# EasyEDA schematic SCH_CLASS_ESP32-S2-MAIN_2024-03-13.json
TITLE: ESP32_S2-MAIN-CONTROL; REV: 1.9; Date: 2023-12-26; Sheet: 1/1; Drawn By: aamirf; Company: Your Company
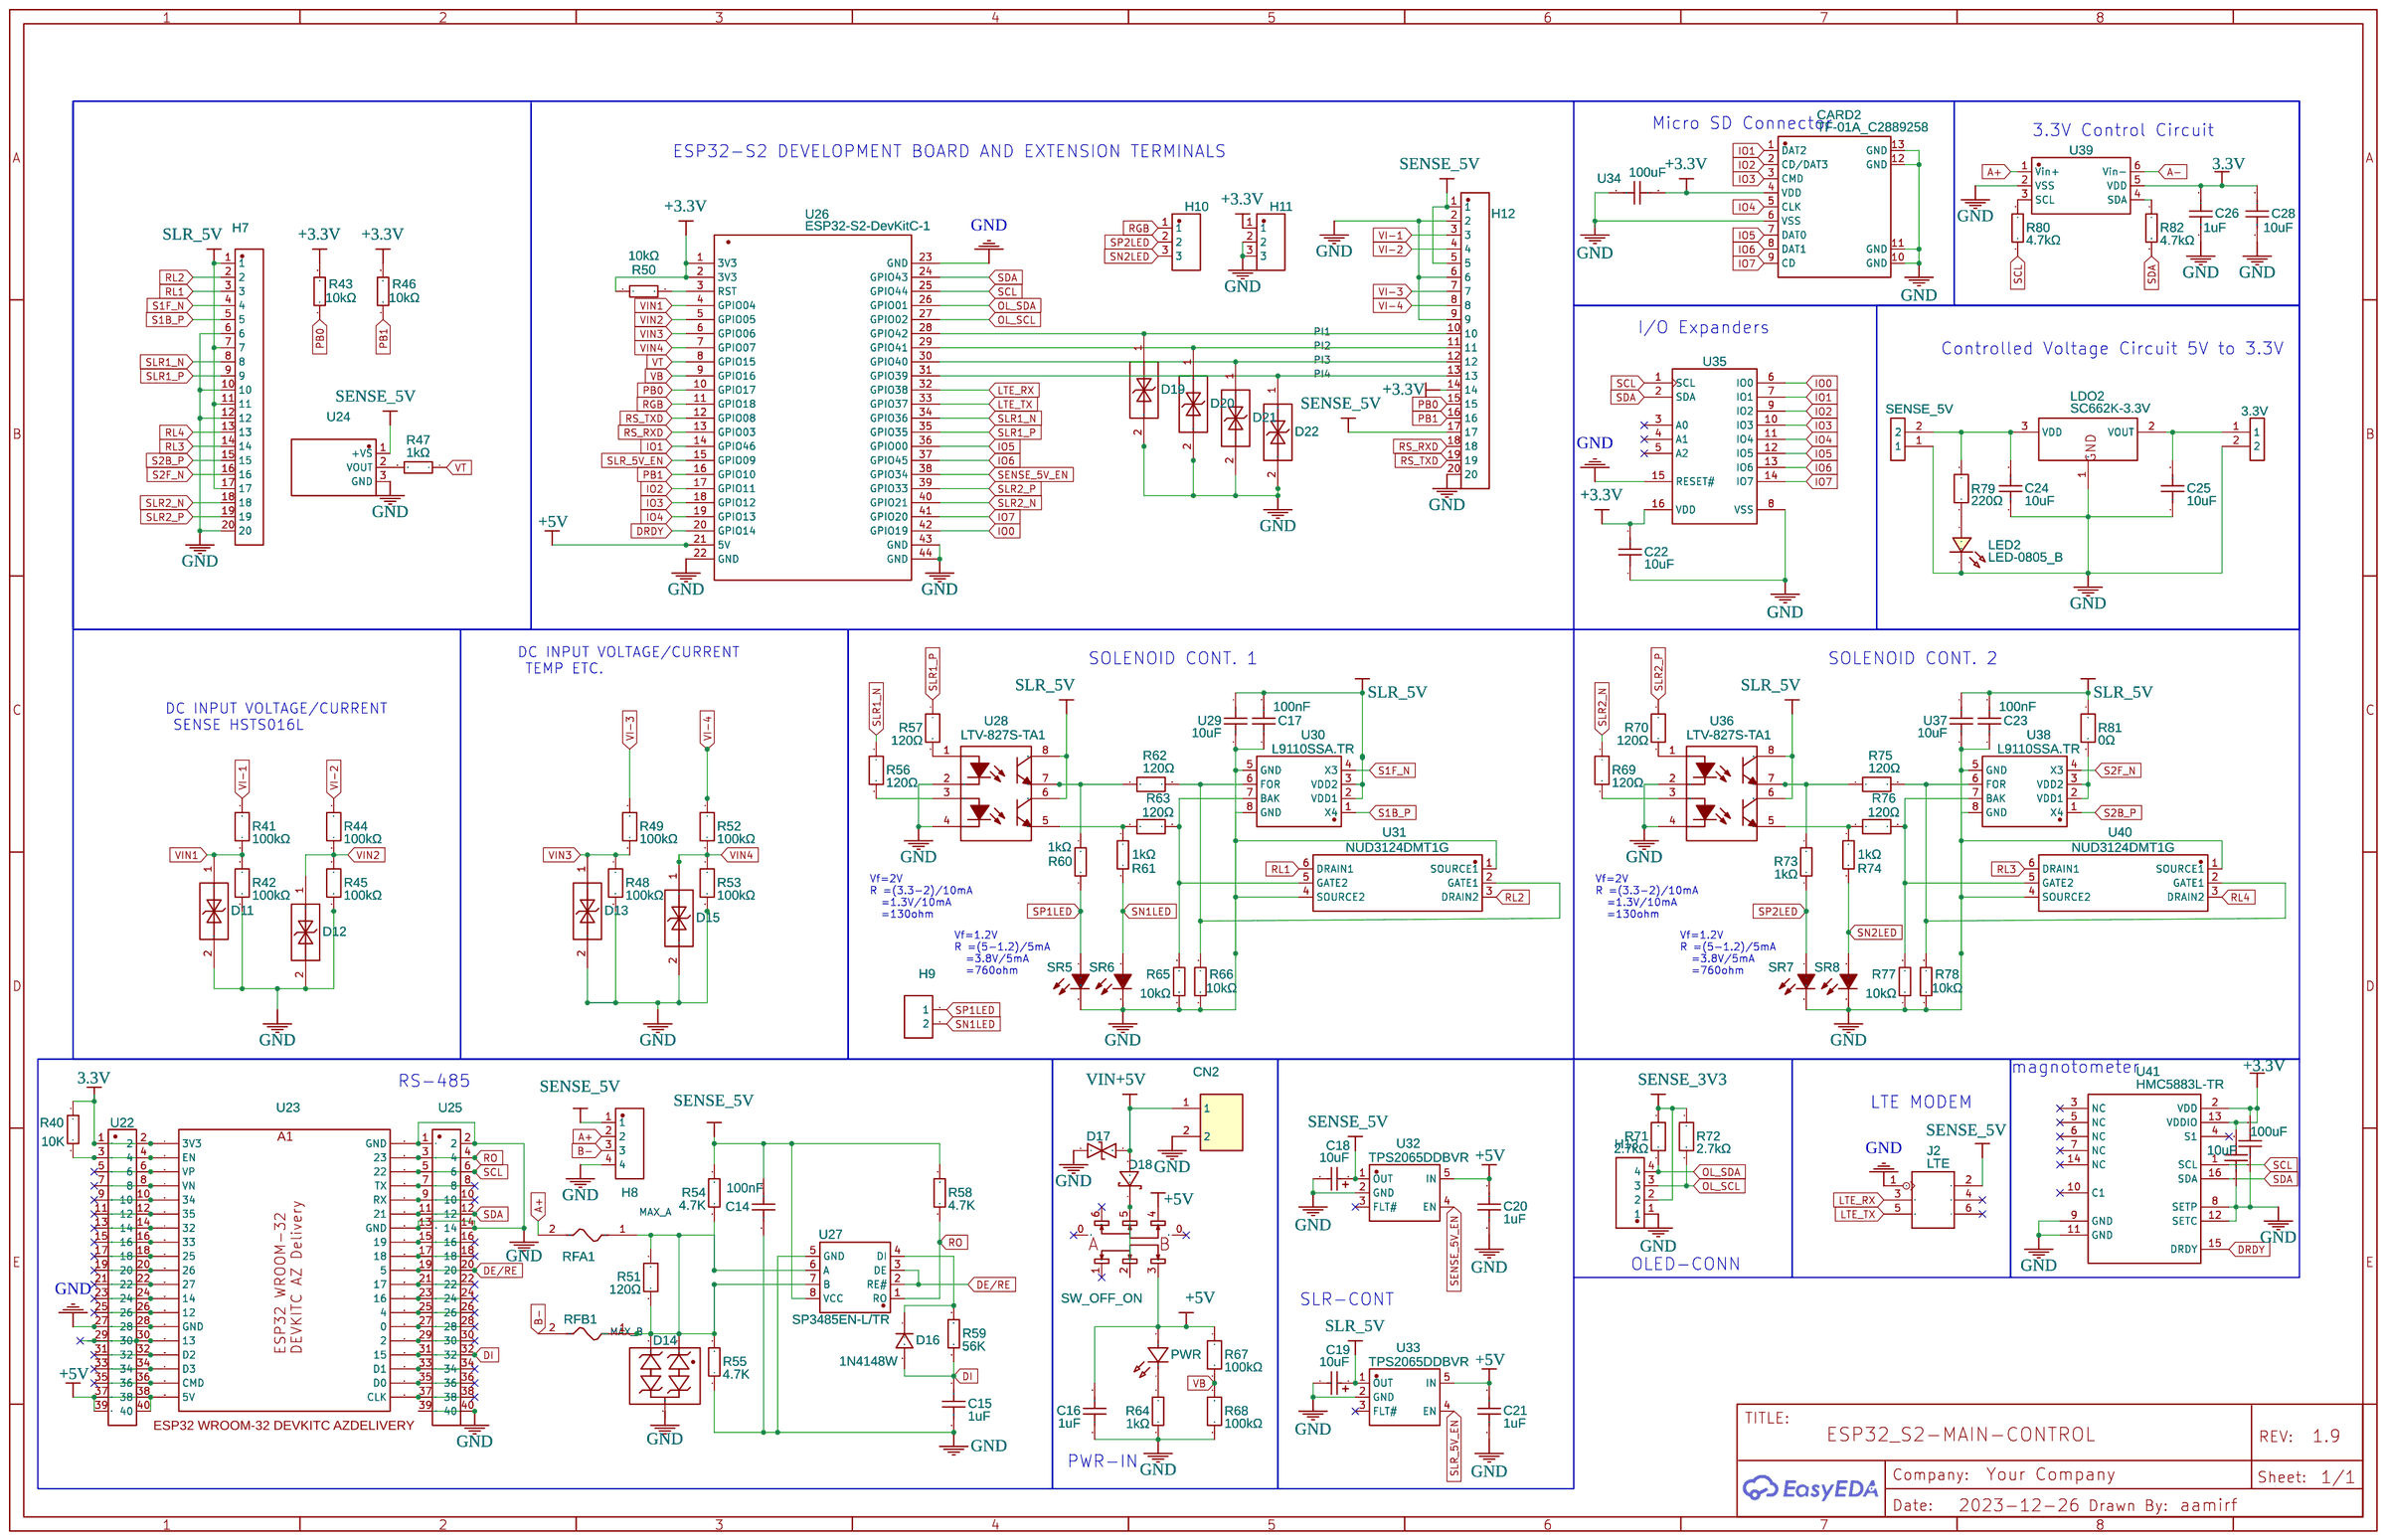
[diagram p0: schematic sheet]

## Parts
C14  100nF  [C0402]
C15  1uF  [C0402]
C16  1uF  [C0402]
C17  100nF  [C0402]
C18  10uF  [CASE-A_3216]
C19  10uF  [CASE-A_3216]
C20  1uF  [C0402]
C21  1uF  [C0402]
C22  10uF  [C0805]
C23  100nF  [C0402]
C24  10uF  [C0805]
C25  10uF  [C0805]
C26  1uF  [C0402]
C27  10uF  [C1206]
C28  10uF  [C0805]
CARD2  TF-01A_C2889258  [TF-SMD_TF-02]
CN2  B2B-PH-K-S(LF)(SN)  [CONN-TH_B2B-PH-K-S]
D11  KESD5311X  [D0402-BI]
D12  KESD5311X  [D0402-BI]
D13  KESD5311X  [D0402-BI]
D14  SM712_C502564  [SOT-23-3_L2.9-W1.6-P1.90-LS2.8-BR]
D15  KESD5311X  [D0402-BI]
D16  1N4148W  [SOD-123_L2.8-W1.8-LS3.7-RD]
D17  LESD5D5.0CT1G  [SOD-523_L1.2-W0.8-LS1.6-BI]
D18  BAT760-7  [SOD-323_L1.8-W1.3-LS2.5-RD]
D19  KESD5311X  [D0402-BI]
D20  KESD5311X  [D0402-BI]
D21  KESD5311X  [D0402-BI]
D22  KESD5311X  [D0402-BI]
H7  KH-2.54PH180-1X20P-L11.5  [HDR-TH_20P-P2.54-V-M]
H8  X6511WV-04H-C30D60  [HDR-TH_4P-P2.54-V-M]
H9  HDR-F-2.54_1x2  [HDR-F-2.54_1X2]
H10  KH-2.54PH180-1X3P-L11.5  [HDR-TH_3P-P2.54-V-M]
H11  KH-2.54PH180-1X3P-L11.5  [HDR-TH_3P-P2.54-V-M]
H12  KH-2.54PH180-1X20P-L11.5  [HDR-TH_20P-P2.54-V-M]
H13  X6511WV-04H-C30D60  [HDR-TH_4P-P2.54-V-M]
J2  LTE  [HEADER 2X3-2.54]
LDO2  SC662K-3.3V  [SOT-23-3_L2.9-W1.3-P1.90-LS2.4-BR]
LED2  LED-0805_B  [LED0805_BLUE]
PWR  16-213/BHC-ZL1M2B6Y/3T  [LED0402-RD_BLUE]
PWR_4V  SENSE_5V  [CONN-02-5-SMD]
PWR_5V  3.3V  [CONN-02-5-SMD]
R40  10K  [R0603]
R41  100kΩ  [R0402]
R42  100kΩ  [R0402]
R43  10kΩ  [R0402]
R44  100kΩ  [R0402]
R45  100kΩ  [R0402]
R46  10kΩ  [R0402]
R47  1kΩ  [R0402]
R48  100kΩ  [R0402]
R49  100kΩ  [R0402]
R50  10kΩ  [R0402]
R51  120Ω  [R0603]
R52  100kΩ  [R0402]
R53  100kΩ  [R0402]
R54  4.7K  [R0603]
R55  4.7K  [R0603]
R56  120Ω  [R0402]
R57  120Ω  [R0402]
R58  4.7K  [R0603]
R59  56K  [R0603]
R60  1kΩ  [R0402]
R61  1kΩ  [R0402]
R62  120Ω  [R0402]
R63  120Ω  [R0402]
R64  1kΩ  [R0402]
R65  10kΩ  [R0402]
R66  10kΩ  [R0402]
R67  100kΩ  [R0402]
R68  100kΩ  [R0402]
R69  120Ω  [R0402]
R70  120Ω  [R0402]
R71  2.7kΩ  [R0402]
R72  2.7kΩ  [R0402]
R73  1kΩ  [R0402]
R74  1kΩ  [R0402]
R75  120Ω  [R0402]
R76  120Ω  [R0402]
R77  10kΩ  [R0402]
R78  10kΩ  [R0402]
R79  220Ω  [R0402]
R80  4.7kΩ  [R0402]
R81  0Ω  [R0603]
R82  4.7kΩ  [R0402]
RFA1  MF-MSMF010-2  [F1812]
RFB1  MF-MSMF010-2  [F1812]
SR5  16-213/GHC-YR1S1/3T  [LED0402-R-RD]
SR6  16-213/SDRC/S530-A3/TR8  [LED0402-RD]
SR7  16-213/GHC-YR1S1/3T  [LED0402-R-RD]
SR8  16-213/SDRC/S530-A3/TR8  [LED0402-RD]
SW2  SW_OFF_ON  [SW-SMD_6P-L7.7-W5.6-P2.50]
U22  SCHLIB_C2685092Connector_SMD_40pin  [C2685092CONNECTOR_SMD_FOOTPRINT]
U23  ESP_32_40_SMD_symbol  [ESP_32_SMD_FOOTPRINT]
U24  LM35DZ/LFT1  [TO-92-3_L4.8-W3.7-P2.54-L]
U25  SCHLIB_C2685092Connector_SMD_40pin  [C2685092CONNECTOR_SMD_FOOTPRINT]
U26  ESP32-S2-DevKitC-1  [ESP32-S2-DEVKITC-1]
U27  SP3485EN-L/TR  [SOIC-8_L5.0-W4.0-P1.27-LS6.0-BL]
U28  LTV-827S-TA1  [SMD-8_6.3MM]
U29  10uF  [C0603]
U30  L9110SSA.TR  [SOP-8_L5.0-W3.9-P1.27-LS6.0-BL]
U31  NUD3124DMT1G  [SC-74-6_L3.0-W1.5-P0.95-LS2.8-BL]
U32  TPS2065DDBVR  [SOT-23-5_L3.0-W1.7-P0.95-LS2.8-BL]
U33  TPS2065DDBVR  [SOT-23-5_L3.0-W1.7-P0.95-LS2.8-BL]
U34  100uF  [C1206]
U35  PCA9557PW,118  [TSSOP-16_L5.0-W4.4-P0.65-LS6.4-BL]
U36  LTV-827S-TA1  [SMD-8_6.3MM]
U37  10uF  [C0603]
U38  L9110SSA.TR  [SOP-8_L5.0-W3.9-P1.27-LS6.0-BL]
U39  MCP3421A0T-E/CH  [SOT-23-6_L2.9-W1.6-P0.95-LS2.8-BR]
U40  NUD3124DMT1G  [SC-74-6_L3.0-W1.5-P0.95-LS2.8-BL]
U41  HMC5883L-TR  [LGA-16_L3.0-W3.0-P0.50-BL_SQ]
U42  100uF  [C1206]

## Library data of the parts
C14 C17 C23 = C1005X5R0J104K050BA: Contributor: lcsc; Supplier: LCSC; Supplier Part: C3845188; Manufacturer: TDK; link: https://lcsc.com/eda_search?q=C3845188&%26type=1&ref=editor
C15 C16 C20 C21 C26 = GRM155R61H105ME05D: Contributor: lcsc; Supplier: LCSC; Supplier Part: C5119299; Manufacturer: muRata(村田); JLCPCB Part Class: Extended Part; link: https://lcsc.com/eda_search?q=C5119299&%26type=1&ref=editor
C18 C19 = CA45A-A-16V-10UF-K: Contributor: LCSC; Supplier: LCSC; Manufacturer: CEC(振华新云); Manufacturer Part: CA45A-A-16V-10uF-K; Supplier Part: C129279; JLCPCB Part Class: Extended Part
C22 C28 = C2012X5R1E106M125AB: Contributor: lcsc; Supplier: LCSC; Supplier Part: C3853143; Manufacturer: TDK
C24 C25 = C2012JB1E106K085AC: Contributor: lcsc; Supplier: LCSC; Supplier Part: C3902947; Manufacturer: TDK
C27 = C3216JB1C106M085AB: Contributor: lcsc; Supplier: LCSC; Supplier Part: C3874147; Manufacturer: TDK
CARD2 = TF-01A_C2889258: Contributor: LCSC; Supplier: LCSC; Supplier Part: C2889258; Manufacturer: Yuandi(台湾元迪); Manufacturer Part: TF-01A; JLCPCB Part Class: Extended Part
CN2 = B2B-PH-K-S(LF)(SN): Contributor: LCSC; Supplier: LCSC; Manufacturer: JST; Supplier Part: C131337; JLCPCB Part Class: Extended Part; link: https://lcsc.com/eda_search?q=C131337&%26type=1&ref=editor
D11-D13 D15 D19-D22 = KESD5311X: Contributor: lcsc; Supplier: LCSC; Supplier Part: C2892495; Manufacturer: KUU; JLCPCB Part Class: Extended Part
D14 = SM712_C502564: Contributor: LCSC; Supplier: LCSC; Supplier Part: C502564; Manufacturer: MDD; Manufacturer Part: SM712; JLCPCB Part Class: Extended Part
D16 = 1N4148W_C81598: Supplier: LCSC; Manufacturer: SEMTECH; image: //image.lceda.cn/szlcsc/C81598.jpg; Supplier Part: C81598; LCSC Assembly: Yes; SMT Type: Basic
D17 = LESD5D5.0CT1G: Contributor: LCSC; Supplier: LCSC; Supplier Part: C383211; Manufacturer: LRC(乐山无线电); JLCPCB Part Class: Extended Part; link: https://lcsc.com/eda_search?q=C383211&%26type=1&ref=editor
D18 = BAT760-7: Contributor: LCSC; Supplier: LCSC; Manufacturer: DIODES(美台); Supplier Part: C124187; JLCPCB Part Class: Extended Part; link: https://lcsc.com/eda_search?q=C124187&%26type=1&ref=editor
H7 H12 = KH-2.54PH180-1X20P-L11.5: Contributor: LCSC; Supplier: LCSC; Supplier Part: C2905493; Manufacturer: kinghelm(金航标); JLCPCB Part Class: Extended Part
H8 H13 = X6511WV-04H-C30D60: Contributor: LCSC; Supplier: LCSC; Supplier Part: C706876; Manufacturer: XKB Connectivity(中国星坤); JLCPCB Part Class: Extended Part
H9 = HDR-F-2.54_1x2: Supplier Part: C49661; Supplier: LCSC; Contributor: LCEDA_Lib
H10 H11 = KH-2.54PH180-1X3P-L11.5: Contributor: LCSC; Supplier: LCSC; Supplier Part: C2932698; Manufacturer: kinghelm(金航标); JLCPCB Part Class: Extended Part
J2 = MALE-HEADER(2X3P-2.54): Contributor: hphoa
LDO2 = SC662K-3.3V: Supplier: LCSC; Manufacturer: FM(富满); Supplier Part: C83932; JLCPCB Part Class: Extended Part
LED2 = LED-0805_B: Manufacturer: 方舟 ARKLED; Manufacturer Part: D-B080508B1-KS2; Supplier Part: C108412; Contributor: LCEDA_Lib
PWR = 16-213/BHC-ZL1M2B6Y/3T: Contributor: lcsc; Supplier: LCSC; Supplier Part: C2844007; Manufacturer: EVERLIGHT(亿光); JLCPCB Part Class: Extended Part
PWR_4V PWR_5V = CONN-02-5-SMD: Manufacturer Part: 950-D-SMD-DS/02; Supplier: Digi-Key; Supplier Part: 3072-950-D-SMD-DS/02-ND; link: https://wecoconnectors.com/wp-content/uploads/pdf_sheets_en/950-D-SMD-DS_en.pdf; Contributor: mubashirlio
R40 = RTT12621JTP: Supplier: LCSC; Manufacturer: RALEC(旺诠); Supplier Part: C105036; Resistance (Ohms): 620; JLCPCB Part Class: Extended Part
R41 R42 R44 R45 R48 R49 R52 R53 R67 R68 = CQ02WGJ0104TCE: Contributor: LCSC; Supplier: LCSC; Supplier Part: C966710; Manufacturer: UNI-ROYAL(厚声); JLCPCB Part Class: Extended Part; link: https://lcsc.com/eda_search?q=C966710&%26type=1&ref=editor
R43 R46 R50 R65 R66 R77 R78 = 0402WGF1002TCE: Supplier: LCSC; Manufacturer: UNI-ROYAL(厚声); Supplier Part: C25744; JLCPCB Part Class: Basic Part; link: https://lcsc.com/eda_search?q=C25744&%26type=1&ref=editor; Package Display: No
R47 R60 R61 R64 R73 R74 = AR02DTD1001: Contributor: LCSC; Supplier: LCSC; Supplier Part: C319807; Manufacturer: Viking(光颉); JLCPCB Part Class: Extended Part; link: https://lcsc.com/eda_search?q=C319807&%26type=1&ref=editor
R51 = FRC0603J121 TS: Contributor: lcsc; Supplier: LCSC; Supplier Part: C2907096; Manufacturer: FOJAN(富捷); JLCPCB Part Class: Extended Part; link: https://lcsc.com/eda_search?q=C2907096&%26type=1&ref=editor
R54 R55 R58 = 0603WAF4701T5E: Supplier: LCSC; Manufacturer: UniOhm; LCSC Assembly: Yes; Supplier Part: C23162; SMT Type: Basic
R56 R57 R62 R63 R69 R70 R75 R76 = RM04FTN1200: Contributor: LCSC; Supplier: LCSC; Supplier Part: C432822; Manufacturer: 大毅科技; JLCPCB Part Class: Extended Part; link: https://lcsc.com/eda_search?q=C432822&%26type=1&ref=editor
R59 = 0603WAF5602T5E: Supplier: LCSC; Manufacturer: UniOhm; LCSC Assembly: Yes; Supplier Part: C23206; SMT Type: Basic
R71 R72 = CR-02FL6---2K7: Contributor: LCSC; Supplier: LCSC; Supplier Part: C409687; Manufacturer: Viking(光颉); JLCPCB Part Class: Extended Part; link: https://lcsc.com/eda_search?q=C409687&%26type=1&ref=editor
R79 = CRCW0402220RFKED: Contributor: LCSC; Supplier: LCSC; Supplier Part: C482103; Manufacturer: VISHAY(威世); JLCPCB Part Class: Extended Part
R80 R82 = RC0402FR-074K7L: Supplier: LCSC; Manufacturer: YAGEO(国巨); Supplier Part: C105871; JLCPCB Part Class: Extended Part
R81 = CR-03JA7----0R: Contributor: LCSC; Supplier: LCSC; Supplier Part: C465460; Manufacturer: Viking(光颉); JLCPCB Part Class: Extended Part; link: https://lcsc.com/eda_search?q=C465460&%26type=1&ref=editor
RFA1 RFB1 = MF-MSMF010-2: Supplier: LCSC; Manufacturer: BOURNS; Supplier Part: C12430; JLCPCB Part Class: Extended Part
SR5 SR7 = 16-213/GHC-YR1S1/3T: Supplier: LCSC; Manufacturer: EVERLIGHT(亿光); Supplier Part: C74338; JLCPCB Part Class: Extended Part
SR6 SR8 = 16-213/SDRC/S530-A3/TR8: Supplier: LCSC; Manufacturer: EVERLIGHT(亿光); Manufacturer Part: 16-213SDRC/S530-A3/TR8; Supplier Part: C71911; JLCPCB Part Class: Extended Part
SW2 = TA-3519S-A1: Contributor: LCSC; Supplier: LCSC; Supplier Part: C514002; Manufacturer: Yuandi(元迪); JLCPCB Part Class: Extended Part; link: https://lcsc.com/eda_search?q=C514002&%26type=1&ref=editor
U22 U25 = SCHLIB_C2685092Connector_SMD_40pin: Contributor: mubashirlio
U23 = ESP_32_40_SMD_symbol: Contributor: aamirf
U24 = LM35DZ/LFT1: Contributor: LCSC; Supplier: LCSC; Manufacturer: TI(德州仪器); Supplier Part: C181511; JLCPCB Part Class: Extended Part; link: https://lcsc.com/eda_search?q=C181511&%26type=1&ref=editor
U26 = ESP32-S2-DevKitC-1: Manufacturer: Espressif Manifacturer; Supplier: Mouser; link: https://www.espressif.com/en/products/socs/esp32-s2; Contributor: kung
U27 = SP3485EN-L/TR: Supplier: LCSC; Manufacturer: EXAR; LCSC Assembly: Yes; image: //image.lceda.cn/szlcsc/C8963.jpg; Supplier Part: C8963; SMT Type: Basic
U28 U36 = -: Supplier: LCSC; Manufacturer: LITEON; Supplier Part: C22112; Package Display: No
U29 U37 = CGB3C1JB0J106M065AC: Contributor: lcsc; Supplier: LCSC; Supplier Part: C3853014; Manufacturer: TDK; link: https://lcsc.com/eda_search?q=C3853014&%26type=1&ref=editor
U30 U38 = L9110SSA.TR: Supplier: LCSC; Supplier Part: C2977409; Manufacturer: I-CORE(中微爱芯); link: https://atta.szlcsc.com//upload/public/pdf/source/20220218/3C4A07BB3A14956AC9371DCD7606795B.pdf; Contributor: LCSC; JLCPCB Part Class: Extended Part
U31 U40 = NUD3124DMT1G: Supplier: LCSC; Supplier Part: C182473; Manufacturer: ON Semicon; Contributor: LCSC; JLCPCB Part Class: Extended Part
U32 U33 = TPS2065DDBVR: Contributor: LCSC; Supplier: LCSC; Supplier Part: C414625; Manufacturer: TI(德州仪器); JLCPCB Part Class: Extended Part
U34 U42 = C1206X5R107K6R3NT: Contributor: lcsc; Supplier: LCSC; Supplier Part: C2844390; Manufacturer: SANYEAR(叁叶源); JLCPCB Part Class: Extended Part
U35 = PCA9557PW,118: Contributor: LCSC; Supplier: LCSC; Manufacturer: NXP(恩智浦); Supplier Part: C141380; JLCPCB Part Class: Extended Part
U39 = MCP3421A0T-E/CH: Contributor: KiCad; Supplier: LCSC; Manufacturer: MICROCHIP(美国微芯); Supplier Part: C29454; JLCPCB Part Class: Extended Part
U41 = HMC5883L-TR: Supplier: LCSC; Manufacturer: null; Supplier Part: C15640; JLCPCB Part Class: Extended Part

## Nets
3.3V: C26.1 C28.2 R40.1 U22.1 U22.2 U23.1(3V3) U39.5(VDD)
+3.3V: C22.2 C27.2 CARD2.4(VDD) H11.1 H12.14 R43.2 R46.2 R50.1 U26.1(3V3) U26.2(3V3) U34.2 U35.16(VDD) U41.2(VDD) U41.13(VDDIO) U42.2
+5V: C16.1 C20.1 C21.1 PWR.2(A) R67.1 SW2.3 SW2.4 U22.37 U22.38 U22.39 U22.40 U23.19(5V) U26.21(5V) U32.5(IN) U33.5(IN)
GND: C14.1 C15.2 C16.2 C17.1 C18.2 C19.2 C20.2 C21.2 C22.1 C23.1 C24.1 C25.1 C26.2 C27.1 C28.1 CARD2.6(VSS) CARD2.10(GND) CARD2.11(GND) CARD2.12(GND) CARD2.13(GND) CN2.2 D11.2 D12.2 D13.2 D14.3 D15.2 D17.1 D19.2 D20.2 D21.2 D22.2 H7.6 H7.10 H7.12 H7.20 H8.4 H11.2 H11.3 H12.2 H12.6 H12.9 H12.20 H13.1 J2.1 LDO2.1(GND) LED2.2 PWR_4V.1 PWR_5V.2 R42.2 R45.2 R48.2 R53.2 R55.1 R64.2 R65.1 R66.1 R68.2 R77.1 R78.1 SR5.2(C) SR6.1(-) SR7.2(C) SR8.1(-) U22.27 U22.28 U23.14(GND) U23.32(GND) U23.38(GND) U24.3(GND) U25.1 U25.2 U25.13 U25.14 U25.39 U25.40 U26.22(GND) U26.23(GND) U26.43(GND) U26.44(GND) U27.5(GND) U28.2 U28.4 U29.2 U30.5(GND) U30.8(GND) U31.1(SOURCE1) U31.4(SOURCE2) U32.2(GND) U33.2(GND) U34.1 U35.8(VSS) U35.15(RESET#) U36.2 U36.4 U37.2 U38.5(GND) U38.8(GND) U39.2(VSS) U40.1(SOURCE1) U40.4(SOURCE2) U41.8(SETP) U41.9(GND) U41.11(GND) U41.12(SETC) U42.1
VIN1: D11.1 R41.2 R42.1 U26.4(GPIO04)
VIN2: D12.1 R44.2 R45.1 U26.5(GPIO05)
VIN3: D13.1 R48.1 R49.2 U26.6(GPIO06)
VIN4: D15.1 R52.2 R53.1 U26.7(GPIO07)
VIN+5V: CN2.1 D17.2 D18.2
A+: H8.2 RFA1.2 U39.1(Vin+)
A-: U39.6(Vin-)
B-: H8.3 RFB1.2
DE/RE: U23.29(5) U25.19 U25.20 U27.2(RE#) U27.3(DE)
DI: C15.1 D16.2(A) R59.1 U23.23(15) U25.31 U25.32
DRDY: U26.20(GPIO14) U41.15(DRDY)
IO0: U26.42(GPIO19) U35.6(IO0)
IO1: CARD2.1(DAT2) U26.14(GPIO46) U35.7(IO1)
IO2: CARD2.2(CD/DAT3) U26.17(GPIO11) U35.9(IO2)
IO3: CARD2.3(CMD) U26.18(GPIO12) U35.10(IO3)
IO4: CARD2.5(CLK) U26.19(GPIO13) U35.11(IO4)
IO5: CARD2.7(DAT0) U26.36(GPIO00) U35.12(IO5)
IO6: CARD2.8(DAT1) U26.37(GPIO45) U35.13(IO6)
IO7: CARD2.9(CD) U26.41(GPIO20) U35.14(IO7)
LTE_RX: J2.3(2) U26.32(GPIO38)
LTE_TX: J2.5(3) U26.33(GPIO37)
MAX_B: D14.1 D14.2 R51.1 R51.2 R54.1 R55.2 RFA1.1 RFB1.1 U27.6(A) U27.7(B)
OL_SCL: H13.3 R72.2 U26.27(GPIO02)
OL_SDA: H13.4 R71.2 U26.26(GPIO01)
PB0: H12.15 R43.1 U26.10(GPIO17)
PB1: H12.16 R46.1 U26.16(GPIO10)
PI1: D19.1 H12.10 U26.28(GPIO42)
PI2: D20.1 H12.11 U26.29(GPIO41)
PI3: D21.1 H12.12 U26.30(GPIO40)
PI4: D22.1 H12.13 U26.31(GPIO39)
RGB: H10.1 U26.11(GPIO18)
RL1: H7.3 U31.6(DRAIN1)
RL2: H7.2 U31.3(DRAIN2)
RL3: H7.14 U40.6(DRAIN1)
RL4: H7.13 U40.3(DRAIN2)
RO: R58.1 U23.37(23) U25.3 U25.4 U27.1(RO)
RS_RXD: H12.18 U26.13(GPIO03)
RS_TXD: H12.19 U26.12(GPIO08)
S1B_P: H7.5 U30.1(X4)
S1F_N: H7.4 U30.4(X3)
S2B_P: H7.15 U38.1(X4)
S2F_N: H7.16 U38.4(X3)
SCL: R80.1 U23.36(22) U25.5 U25.6 U26.25(GPIO44) U35.1(SCL) U41.1(SCL)
SDA: R82.2 U23.33(21) U25.11 U25.12 U26.24(GPIO43) U35.2(SDA) U41.16(SDA)
SENSE_3V3: H13.2 R71.1 R72.1
SENSE_5V: C14.2 C18.1 H8.1 H12.1 H12.5 H12.17 J2.2(6) R54.2 R58.2 U24.1(+VS) U27.8(VCC) U32.1(OUT)
SENSE_5V_EN: U26.38(GPIO34) U32.4(EN)
SLR1_N: H7.8 R56.1 U26.34(GPIO36)
SLR1_P: H7.9 R57.1 U26.35(GPIO35)
SLR2_N: H7.18 R69.1 U26.40(GPIO21)
SLR2_P: H7.19 R70.1 U26.39(GPIO33)
SLR_5V: C17.2 C19.1 C23.2 H7.1 H7.7 H7.11 H7.17 R81.1 U28.6 U28.8 U29.1 U30.2(VDD1) U30.3(VDD2) U33.1(OUT) U36.6 U36.8 U37.1
SLR_5V_EN: U26.15(GPIO09) U33.4(EN)
SN1LED: H9.2 R61.2 SR6.2(+)
SN2LED: H10.3 R74.2 SR8.2(+)
SP1LED: H9.1 R60.2 SR5.1(A)
SP2LED: H10.2 R73.2 SR7.1(A)
VB: R67.2 R68.1 U26.9(GPIO16)
VI-1: H12.3 R41.1
VI-2: H12.4 R44.1
VI-3: H12.7 R49.1
VI-4: H12.8 R52.1
VT: R47.1 U26.8(GPIO15)
Net-(C24-2): C24.2 LDO2.3(VDD) PWR_4V.2 R79.2
Net-(C25-2): C25.2 LDO2.2(VOUT) PWR_5V.1
Net-(D16-1): D16.1(K) R59.2 U27.4(DI)
Net-(D18-1): D18.1 SW2.2 SW2.5
Net-(LED2-1): LED2.1 R79.1
Net-(PWR-1): PWR.1(K) R64.1
Net-(R40-2): R40.2 U22.3 U22.4 U23.2(EN)
Net-(R47-2): R47.2 U24.2(VOUT)
Net-(R50-2): R50.2 U26.3(RST)
Net-(R56-2): R56.2 U28.3
Net-(R57-2): R57.2 U28.1
Net-(R60-1): R60.1 R62.1 U28.7
Net-(R61-1): R61.1 R63.1 U28.5
Net-(R62-2): R62.2 R66.2 U30.6(FOR) U31.2(GATE1)
Net-(R63-2): R63.2 R65.2 U30.7(BAK) U31.5(GATE2)
Net-(R69-2): R69.2 U36.3
Net-(R70-2): R70.2 U36.1
Net-(R73-1): R73.1 R75.1 U36.7
Net-(R74-1): R74.1 R76.1 U36.5
Net-(R75-2): R75.2 R78.2 U38.6(FOR) U40.2(GATE1)
Net-(R76-2): R76.2 R77.2 U38.7(BAK) U40.5(GATE2)
Net-(R80-2): R80.2 U39.3(SCL)
Net-(R81-2): R81.2 U38.2(VDD1) U38.3(VDD2)
Net-(R82-1): R82.1 U39.4(SDA)
Net-(U22-5): U22.5 U22.6 U23.3(VP)
Net-(U22-7): U22.7 U22.8 U23.4(VN)
Net-(U22-9): U22.9 U22.10 U23.5(34)
Net-(U22-11): U22.11 U22.12 U23.6(35)
Net-(U22-13): U22.13 U22.14 U23.7(32)
Net-(U22-15): U22.15 U22.16 U23.8(33)
Net-(U22-17): U22.17 U22.18 U23.9(25)
Net-(U22-19): U22.19 U22.20 U23.10(26)
Net-(U22-21): U22.21 U22.22 U23.11(27)
Net-(U22-23): U22.23 U22.24 U23.12(14)
Net-(U22-25): U22.25 U22.26 U23.13(12)
Net-(U22-29): U22.29 U22.30 U23.15(13)
Net-(U22-31): U22.31 U22.32 U23.16(D2)
Net-(U22-33): U22.33 U22.34 U23.17(D3)
Net-(U22-35): U22.35 U22.36 U23.18(CMD)
Net-(U23-20): U23.20(CLK) U25.37 U25.38
Net-(U23-21): U23.21(D0) U25.35 U25.36
Net-(U23-22): U23.22(D1) U25.33 U25.34
Net-(U23-24): U23.24(2) U25.29 U25.30
Net-(U23-25): U23.25(0) U25.27 U25.28
Net-(U23-26): U23.26(4) U25.25 U25.26
Net-(U23-27): U23.27(16) U25.23 U25.24
Net-(U23-28): U23.28(17) U25.21 U25.22
Net-(U23-30): U23.30(18) U25.17 U25.18
Net-(U23-31): U23.31(19) U25.15 U25.16
Net-(U23-34): U23.34(RX) U25.9 U25.10
Net-(U23-35): U23.35(TX) U25.7 U25.8

Not connected (* = marked no-connect by the designer): J2 4(5)* 6(4)*; SW2 0* 1* 6*; U32 3(FLT#)*; U33 3(FLT#)*; U35 3(A0)* 4(A1)* 5(A2)*; U41 3(NC)* 4(S1)* 5(NC)* 6(NC)* 7(NC)* 10(C1)* 14(NC)*

## Notes on the sheet
- Micro SD Connector
- 3.3V Control Circuit
- ESP32-S2 DEVELOPMENT BOARD AND EXTENSION TERMINALS
- I/O Expanders
- Controlled Voltage Circuit 5V to 3.3V
- DC INPUT VOLTAGE/CURRENT
   TEMP ETC.
- SOLENOID CONT. 1
- SOLENOID CONT. 2
- DC INPUT VOLTAGE/CURRENT
   SENSE HSTS016L
- Vf=2V
  R =(3.3-2)/10mA
    =1.3V/10mA
    =130ohm
- Vf=2V
  R =(3.3-2)/10mA
    =1.3V/10mA
    =130ohm
- Vf=1.2V
  R =(5-1.2)/5mA
    =3.8V/5mA
    =760ohm
- Vf=1.2V
  R =(5-1.2)/5mA
    =3.8V/5mA
    =760ohm
- magnotometer
- RS-485
- LTE MODEM
- OLED-CONN
- SLR-CONT
- PWR-IN
